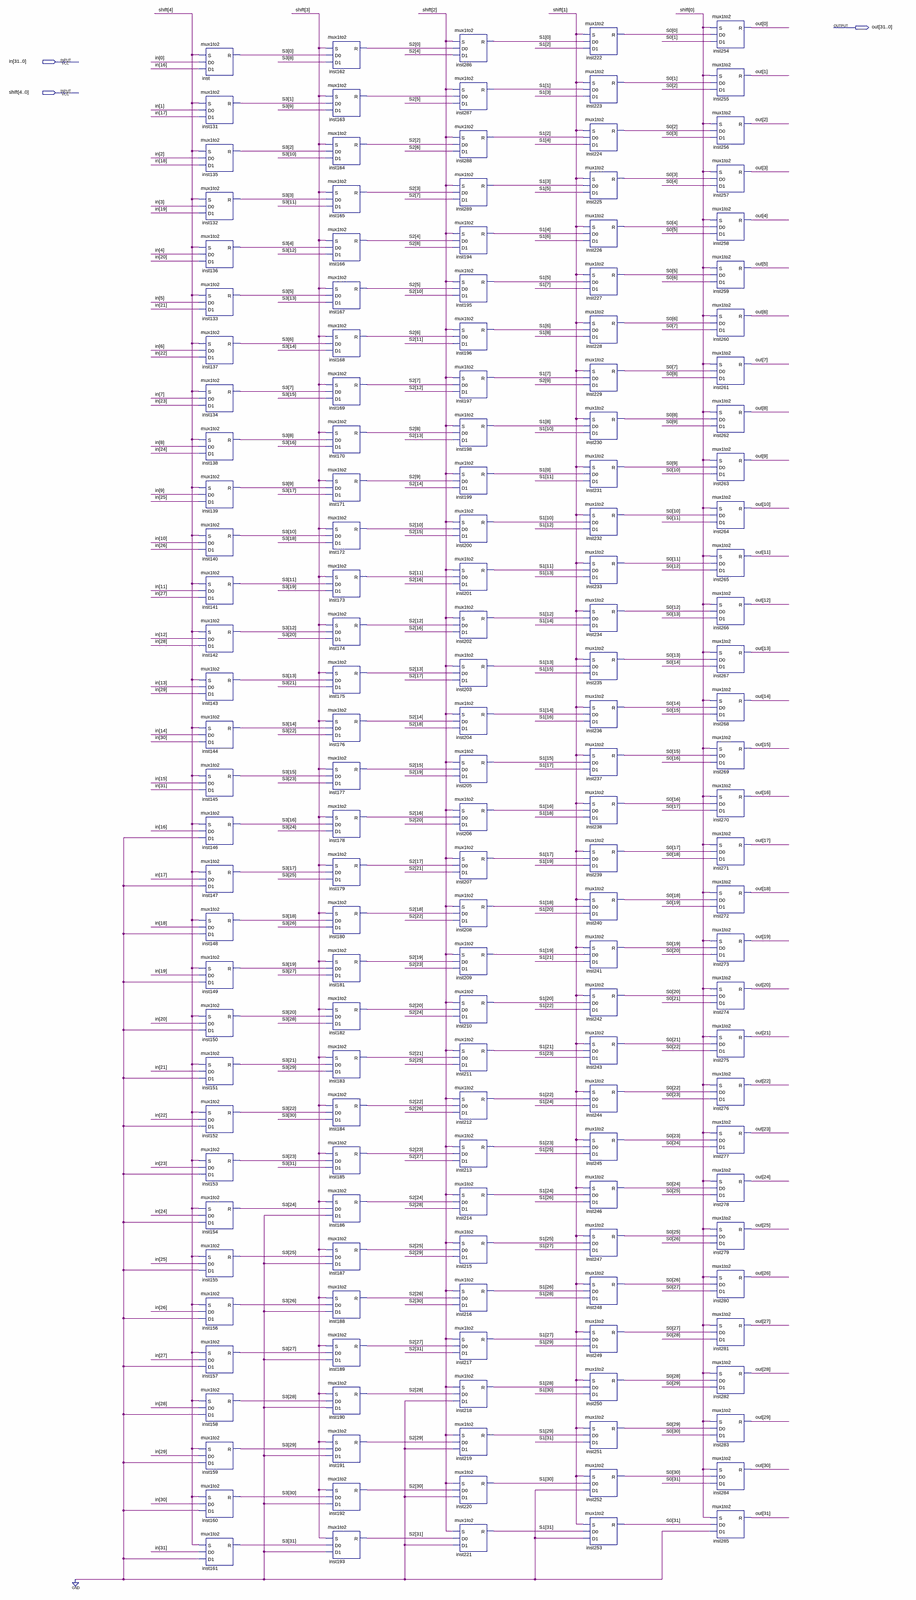
[diagram p0: schematic sheet, whole]
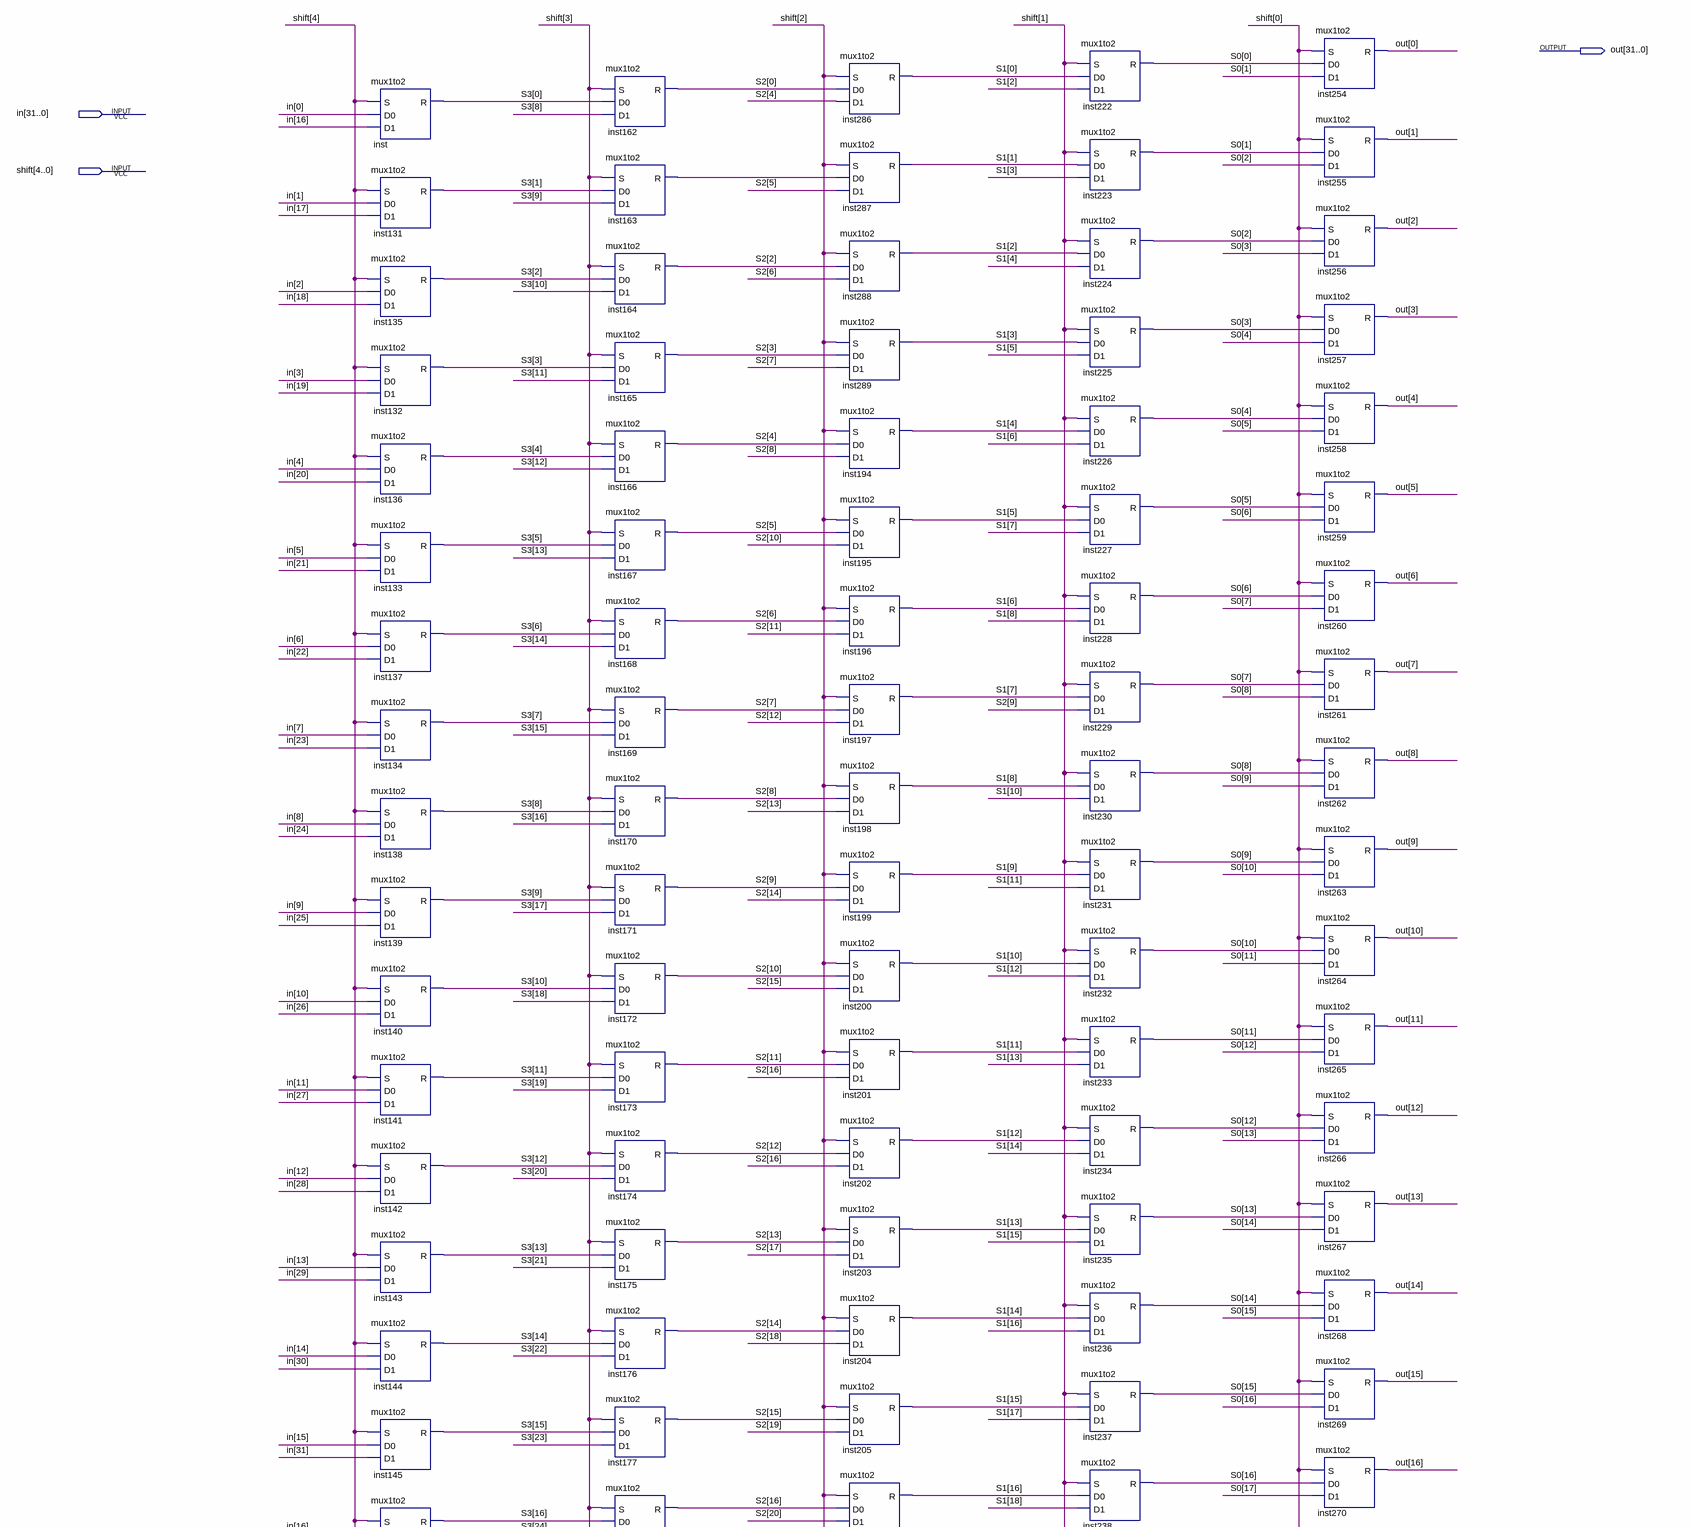
[diagram p1: schematic sheet, upper part]
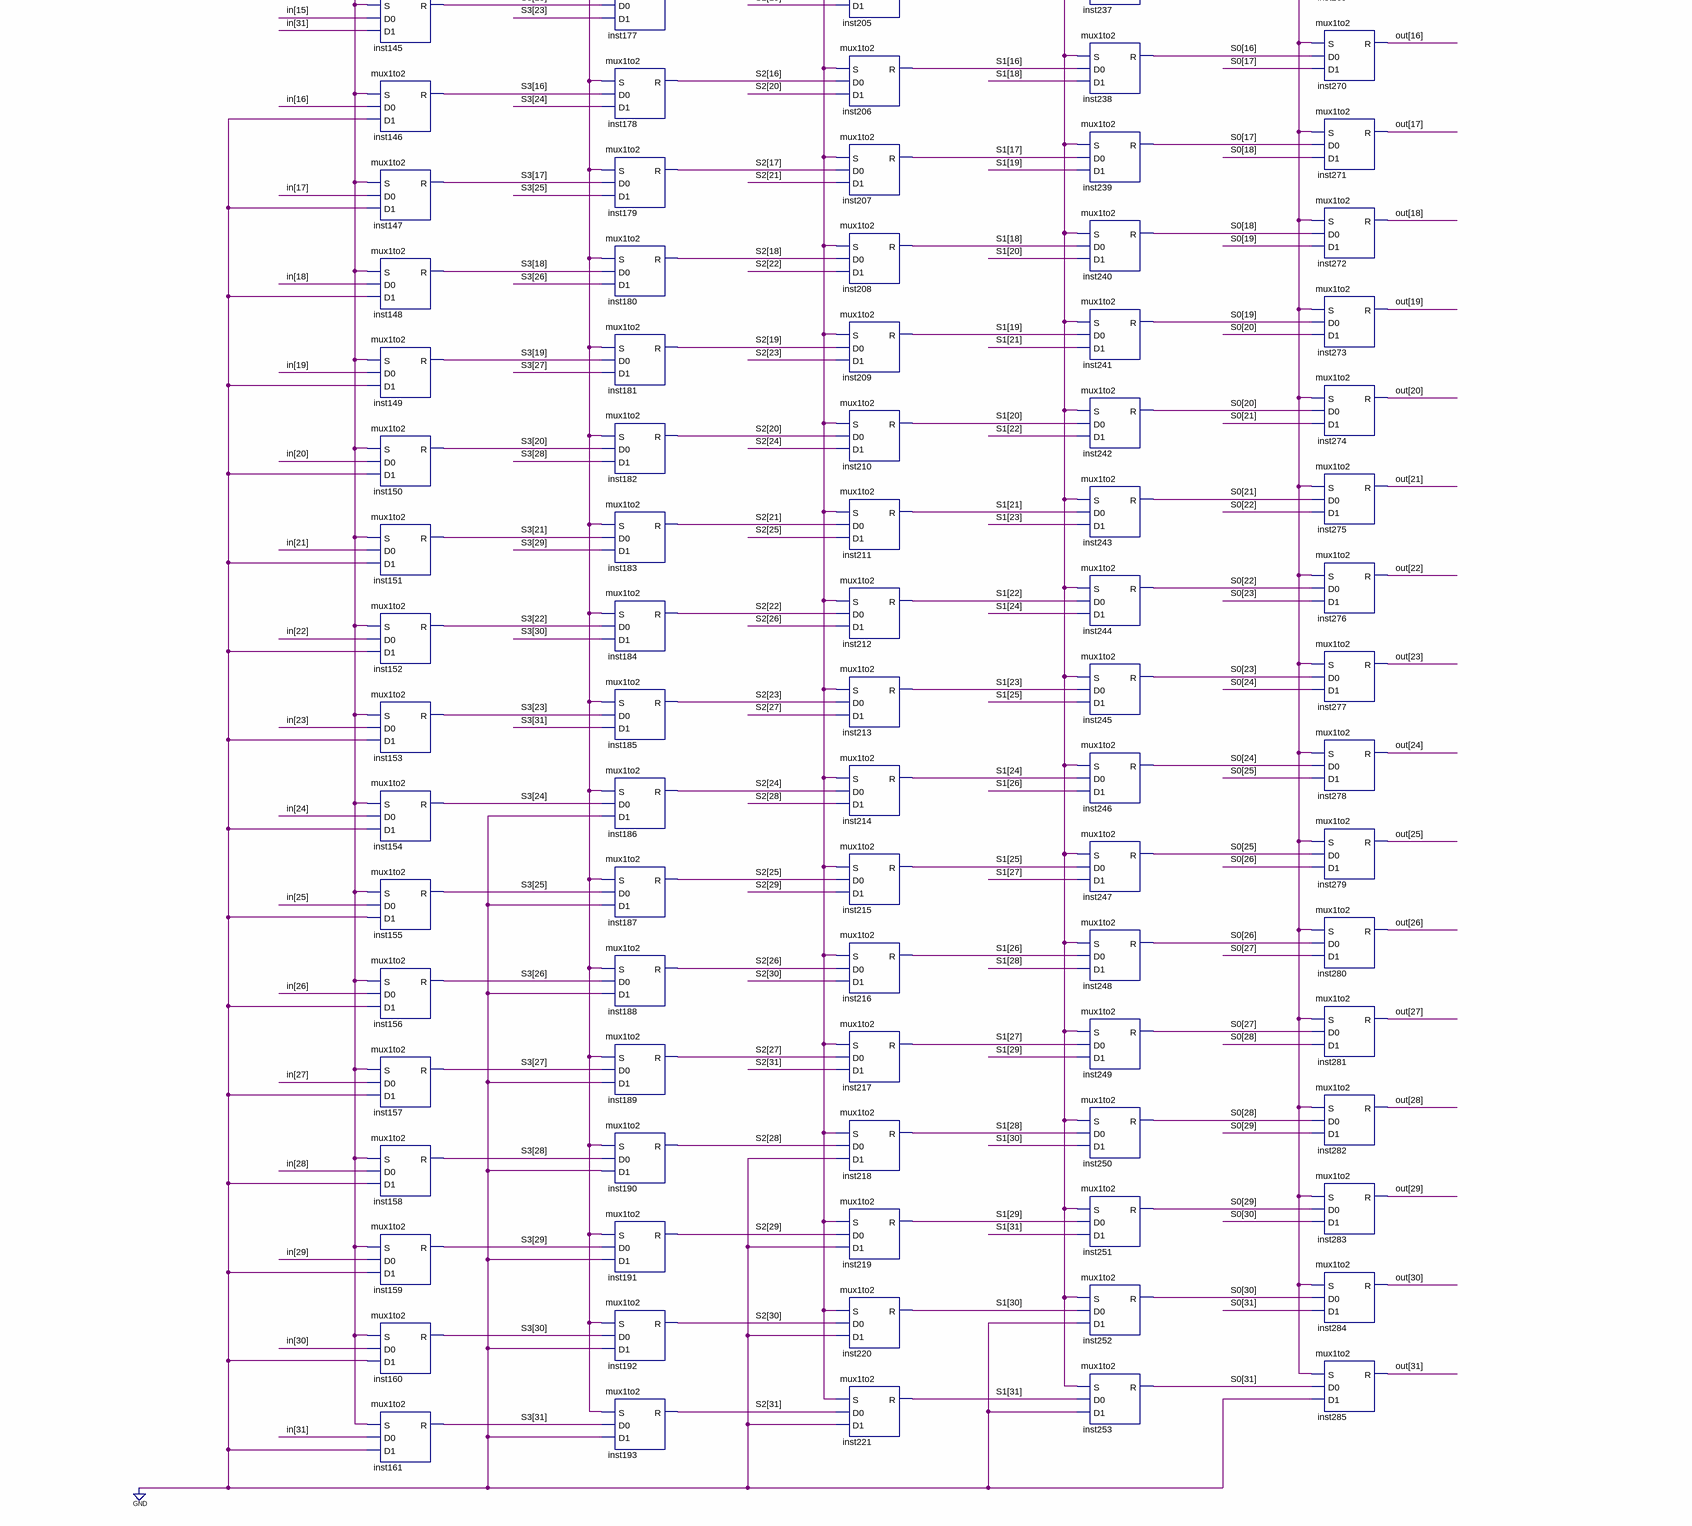
[diagram p2: schematic sheet, lower part]
// Quartus schematic ShiftRight.bdf as structural Verilog: 160 symbols, 3 pins
module ShiftRight (
  input  [31:0] in,
  input  [4:0] shift,
  output [31:0] out
);

  wire inst163_r;
  wire [31:0] S0, S1, S2, S3;

  mux1to2 inst (.S(shift[4]), .D0(in[0]), .D1(in[16]), .R(S3[0]));
  mux1to2 inst131 (.S(shift[4]), .D0(in[1]), .D1(in[17]), .R(S3[1]));
  mux1to2 inst135 (.S(shift[4]), .D0(in[2]), .D1(in[18]), .R(S3[2]));
  mux1to2 inst132 (.S(shift[4]), .D0(in[3]), .D1(in[19]), .R(S3[3]));
  mux1to2 inst136 (.S(shift[4]), .D0(in[4]), .D1(in[20]), .R(S3[4]));
  mux1to2 inst133 (.S(shift[4]), .D0(in[5]), .D1(in[21]), .R(S3[5]));
  mux1to2 inst137 (.S(shift[4]), .D0(in[6]), .D1(in[22]), .R(S3[6]));
  mux1to2 inst134 (.S(shift[4]), .D0(in[7]), .D1(in[23]), .R(S3[7]));
  mux1to2 inst138 (.S(shift[4]), .D0(in[8]), .D1(in[24]), .R(S3[8]));
  mux1to2 inst139 (.S(shift[4]), .D0(in[9]), .D1(in[25]), .R(S3[9]));
  mux1to2 inst140 (.S(shift[4]), .D0(in[10]), .D1(in[26]), .R(S3[10]));
  mux1to2 inst141 (.S(shift[4]), .D0(in[11]), .D1(in[27]), .R(S3[11]));
  mux1to2 inst142 (.S(shift[4]), .D0(in[12]), .D1(in[28]), .R(S3[12]));
  mux1to2 inst143 (.S(shift[4]), .D0(in[13]), .D1(in[29]), .R(S3[13]));
  mux1to2 inst144 (.S(shift[4]), .D0(in[14]), .D1(in[30]), .R(S3[14]));
  mux1to2 inst145 (.S(shift[4]), .D0(in[15]), .D1(in[31]), .R(S3[15]));
  mux1to2 inst146 (.S(shift[4]), .D0(in[16]), .D1(1'b0), .R(S3[16]));
  mux1to2 inst147 (.S(shift[4]), .D0(in[17]), .D1(1'b0), .R(S3[17]));
  mux1to2 inst148 (.S(shift[4]), .D0(in[18]), .D1(1'b0), .R(S3[18]));
  mux1to2 inst149 (.S(shift[4]), .D0(in[19]), .D1(1'b0), .R(S3[19]));
  mux1to2 inst150 (.S(shift[4]), .D0(in[20]), .D1(1'b0), .R(S3[20]));
  mux1to2 inst151 (.S(shift[4]), .D0(in[21]), .D1(1'b0), .R(S3[21]));
  mux1to2 inst152 (.S(shift[4]), .D0(in[22]), .D1(1'b0), .R(S3[22]));
  mux1to2 inst153 (.S(shift[4]), .D0(in[23]), .D1(1'b0), .R(S3[23]));
  mux1to2 inst154 (.S(shift[4]), .D0(in[24]), .D1(1'b0), .R(S3[24]));
  mux1to2 inst155 (.S(shift[4]), .D0(in[25]), .D1(1'b0), .R(S3[25]));
  mux1to2 inst156 (.S(shift[4]), .D0(in[26]), .D1(1'b0), .R(S3[26]));
  mux1to2 inst157 (.S(shift[4]), .D0(in[27]), .D1(1'b0), .R(S3[27]));
  mux1to2 inst158 (.S(shift[4]), .D0(in[28]), .D1(1'b0), .R(S3[28]));
  mux1to2 inst159 (.S(shift[4]), .D0(in[29]), .D1(1'b0), .R(S3[29]));
  mux1to2 inst160 (.S(shift[4]), .D0(in[30]), .D1(1'b0), .R(S3[30]));
  mux1to2 inst161 (.S(shift[4]), .D0(in[31]), .D1(1'b0), .R(S3[31]));
  mux1to2 inst162 (.S(shift[3]), .D0(S3[0]), .D1(S3[8]), .R(S2[0]));
  mux1to2 inst163 (.S(shift[3]), .D0(S3[1]), .D1(S3[9]), .R(inst163_r));
  mux1to2 inst164 (.S(shift[3]), .D0(S3[2]), .D1(S3[10]), .R(S2[2]));
  mux1to2 inst165 (.S(shift[3]), .D0(S3[3]), .D1(S3[11]), .R(S2[3]));
  mux1to2 inst166 (.S(shift[3]), .D0(S3[4]), .D1(S3[12]), .R(S2[4]));
  mux1to2 inst167 (.S(shift[3]), .D0(S3[5]), .D1(S3[13]), .R(S2[5]));
  mux1to2 inst168 (.S(shift[3]), .D0(S3[6]), .D1(S3[14]), .R(S2[6]));
  mux1to2 inst169 (.S(shift[3]), .D0(S3[7]), .D1(S3[15]), .R(S2[7]));
  mux1to2 inst170 (.S(shift[3]), .D0(S3[8]), .D1(S3[16]), .R(S2[8]));
  mux1to2 inst171 (.S(shift[3]), .D0(S3[9]), .D1(S3[17]), .R(S2[9]));
  mux1to2 inst172 (.S(shift[3]), .D0(S3[10]), .D1(S3[18]), .R(S2[10]));
  mux1to2 inst173 (.S(shift[3]), .D0(S3[11]), .D1(S3[19]), .R(S2[11]));
  mux1to2 inst174 (.S(shift[3]), .D0(S3[12]), .D1(S3[20]), .R(S2[12]));
  mux1to2 inst175 (.S(shift[3]), .D0(S3[13]), .D1(S3[21]), .R(S2[13]));
  mux1to2 inst176 (.S(shift[3]), .D0(S3[14]), .D1(S3[22]), .R(S2[14]));
  mux1to2 inst177 (.S(shift[3]), .D0(S3[15]), .D1(S3[23]), .R(S2[15]));
  mux1to2 inst178 (.S(shift[3]), .D0(S3[16]), .D1(S3[24]), .R(S2[16]));
  mux1to2 inst179 (.S(shift[3]), .D0(S3[17]), .D1(S3[25]), .R(S2[17]));
  mux1to2 inst180 (.S(shift[3]), .D0(S3[18]), .D1(S3[26]), .R(S2[18]));
  mux1to2 inst181 (.S(shift[3]), .D0(S3[19]), .D1(S3[27]), .R(S2[19]));
  mux1to2 inst182 (.S(shift[3]), .D0(S3[20]), .D1(S3[28]), .R(S2[20]));
  mux1to2 inst183 (.S(shift[3]), .D0(S3[21]), .D1(S3[29]), .R(S2[21]));
  mux1to2 inst184 (.S(shift[3]), .D0(S3[22]), .D1(S3[30]), .R(S2[22]));
  mux1to2 inst185 (.S(shift[3]), .D0(S3[23]), .D1(S3[31]), .R(S2[23]));
  mux1to2 inst186 (.S(shift[3]), .D0(S3[24]), .D1(1'b0), .R(S2[24]));
  mux1to2 inst187 (.S(shift[3]), .D0(S3[25]), .D1(1'b0), .R(S2[25]));
  mux1to2 inst188 (.S(shift[3]), .D0(S3[26]), .D1(1'b0), .R(S2[26]));
  mux1to2 inst189 (.S(shift[3]), .D0(S3[27]), .D1(1'b0), .R(S2[27]));
  mux1to2 inst190 (.S(shift[3]), .D0(S3[28]), .D1(1'b0), .R(S2[28]));
  mux1to2 inst191 (.S(shift[3]), .D0(S3[29]), .D1(1'b0), .R(S2[29]));
  mux1to2 inst192 (.S(shift[3]), .D0(S3[30]), .D1(1'b0), .R(S2[30]));
  mux1to2 inst193 (.S(shift[3]), .D0(S3[31]), .D1(1'b0), .R(S2[31]));
  mux1to2 inst286 (.S(shift[2]), .D0(S2[0]), .D1(S2[4]), .R(S1[0]));
  mux1to2 inst287 (.S(shift[2]), .D0(inst163_r), .D1(S2[5]), .R(S1[1]));
  mux1to2 inst288 (.S(shift[2]), .D0(S2[2]), .D1(S2[6]), .R(S1[2]));
  mux1to2 inst289 (.S(shift[2]), .D0(S2[3]), .D1(S2[7]), .R(S1[3]));
  mux1to2 inst194 (.S(shift[2]), .D0(S2[4]), .D1(S2[8]), .R(S1[4]));
  mux1to2 inst195 (.S(shift[2]), .D0(S2[5]), .D1(S2[10]), .R(S1[5]));
  mux1to2 inst196 (.S(shift[2]), .D0(S2[6]), .D1(S2[11]), .R(S1[6]));
  mux1to2 inst197 (.S(shift[2]), .D0(S2[7]), .D1(S2[12]), .R(S1[7]));
  mux1to2 inst198 (.S(shift[2]), .D0(S2[8]), .D1(S2[13]), .R(S1[8]));
  mux1to2 inst199 (.S(shift[2]), .D0(S2[9]), .D1(S2[14]), .R(S1[9]));
  mux1to2 inst200 (.S(shift[2]), .D0(S2[10]), .D1(S2[15]), .R(S1[10]));
  mux1to2 inst201 (.S(shift[2]), .D0(S2[11]), .D1(S2[16]), .R(S1[11]));
  mux1to2 inst202 (.S(shift[2]), .D0(S2[12]), .D1(S2[16]), .R(S1[12]));
  mux1to2 inst203 (.S(shift[2]), .D0(S2[13]), .D1(S2[17]), .R(S1[13]));
  mux1to2 inst204 (.S(shift[2]), .D0(S2[14]), .D1(S2[18]), .R(S1[14]));
  mux1to2 inst205 (.S(shift[2]), .D0(S2[15]), .D1(S2[19]), .R(S1[15]));
  mux1to2 inst206 (.S(shift[2]), .D0(S2[16]), .D1(S2[20]), .R(S1[16]));
  mux1to2 inst207 (.S(shift[2]), .D0(S2[17]), .D1(S2[21]), .R(S1[17]));
  mux1to2 inst208 (.S(shift[2]), .D0(S2[18]), .D1(S2[22]), .R(S1[18]));
  mux1to2 inst209 (.S(shift[2]), .D0(S2[19]), .D1(S2[23]), .R(S1[19]));
  mux1to2 inst210 (.S(shift[2]), .D0(S2[20]), .D1(S2[24]), .R(S1[20]));
  mux1to2 inst211 (.S(shift[2]), .D0(S2[21]), .D1(S2[25]), .R(S1[21]));
  mux1to2 inst212 (.S(shift[2]), .D0(S2[22]), .D1(S2[26]), .R(S1[22]));
  mux1to2 inst213 (.S(shift[2]), .D0(S2[23]), .D1(S2[27]), .R(S1[23]));
  mux1to2 inst214 (.S(shift[2]), .D0(S2[24]), .D1(S2[28]), .R(S1[24]));
  mux1to2 inst215 (.S(shift[2]), .D0(S2[25]), .D1(S2[29]), .R(S1[25]));
  mux1to2 inst216 (.S(shift[2]), .D0(S2[26]), .D1(S2[30]), .R(S1[26]));
  mux1to2 inst217 (.S(shift[2]), .D0(S2[27]), .D1(S2[31]), .R(S1[27]));
  mux1to2 inst218 (.S(shift[2]), .D0(S2[28]), .D1(1'b0), .R(S1[28]));
  mux1to2 inst219 (.S(shift[2]), .D0(S2[29]), .D1(1'b0), .R(S1[29]));
  mux1to2 inst220 (.S(shift[2]), .D0(S2[30]), .D1(1'b0), .R(S1[30]));
  mux1to2 inst221 (.S(shift[2]), .D0(S2[31]), .D1(1'b0), .R(S1[31]));
  mux1to2 inst222 (.S(shift[1]), .D0(S1[0]), .D1(S1[2]), .R(S0[0]));
  mux1to2 inst223 (.S(shift[1]), .D0(S1[1]), .D1(S1[3]), .R(S0[1]));
  mux1to2 inst224 (.S(shift[1]), .D0(S1[2]), .D1(S1[4]), .R(S0[2]));
  mux1to2 inst225 (.S(shift[1]), .D0(S1[3]), .D1(S1[5]), .R(S0[3]));
  mux1to2 inst226 (.S(shift[1]), .D0(S1[4]), .D1(S1[6]), .R(S0[4]));
  mux1to2 inst227 (.S(shift[1]), .D0(S1[5]), .D1(S1[7]), .R(S0[5]));
  mux1to2 inst228 (.S(shift[1]), .D0(S1[6]), .D1(S1[8]), .R(S0[6]));
  mux1to2 inst229 (.S(shift[1]), .D0(S1[7]), .D1(S2[9]), .R(S0[7]));
  mux1to2 inst230 (.S(shift[1]), .D0(S1[8]), .D1(S1[10]), .R(S0[8]));
  mux1to2 inst231 (.S(shift[1]), .D0(S1[9]), .D1(S1[11]), .R(S0[9]));
  mux1to2 inst232 (.S(shift[1]), .D0(S1[10]), .D1(S1[12]), .R(S0[10]));
  mux1to2 inst233 (.S(shift[1]), .D0(S1[11]), .D1(S1[13]), .R(S0[11]));
  mux1to2 inst234 (.S(shift[1]), .D0(S1[12]), .D1(S1[14]), .R(S0[12]));
  mux1to2 inst235 (.S(shift[1]), .D0(S1[13]), .D1(S1[15]), .R(S0[13]));
  mux1to2 inst236 (.S(shift[1]), .D0(S1[14]), .D1(S1[16]), .R(S0[14]));
  mux1to2 inst237 (.S(shift[1]), .D0(S1[15]), .D1(S1[17]), .R(S0[15]));
  mux1to2 inst238 (.S(shift[1]), .D0(S1[16]), .D1(S1[18]), .R(S0[16]));
  mux1to2 inst239 (.S(shift[1]), .D0(S1[17]), .D1(S1[19]), .R(S0[17]));
  mux1to2 inst240 (.S(shift[1]), .D0(S1[18]), .D1(S1[20]), .R(S0[18]));
  mux1to2 inst241 (.S(shift[1]), .D0(S1[19]), .D1(S1[21]), .R(S0[19]));
  mux1to2 inst242 (.S(shift[1]), .D0(S1[20]), .D1(S1[22]), .R(S0[20]));
  mux1to2 inst243 (.S(shift[1]), .D0(S1[21]), .D1(S1[23]), .R(S0[21]));
  mux1to2 inst244 (.S(shift[1]), .D0(S1[22]), .D1(S1[24]), .R(S0[22]));
  mux1to2 inst245 (.S(shift[1]), .D0(S1[23]), .D1(S1[25]), .R(S0[23]));
  mux1to2 inst246 (.S(shift[1]), .D0(S1[24]), .D1(S1[26]), .R(S0[24]));
  mux1to2 inst247 (.S(shift[1]), .D0(S1[25]), .D1(S1[27]), .R(S0[25]));
  mux1to2 inst248 (.S(shift[1]), .D0(S1[26]), .D1(S1[28]), .R(S0[26]));
  mux1to2 inst249 (.S(shift[1]), .D0(S1[27]), .D1(S1[29]), .R(S0[27]));
  mux1to2 inst250 (.S(shift[1]), .D0(S1[28]), .D1(S1[30]), .R(S0[28]));
  mux1to2 inst251 (.S(shift[1]), .D0(S1[29]), .D1(S1[31]), .R(S0[29]));
  mux1to2 inst252 (.S(shift[1]), .D0(S1[30]), .D1(1'b0), .R(S0[30]));
  mux1to2 inst253 (.S(shift[1]), .D0(S1[31]), .D1(1'b0), .R(S0[31]));
  mux1to2 inst254 (.S(shift[0]), .D0(S0[0]), .D1(S0[1]), .R(out[0]));
  mux1to2 inst255 (.S(shift[0]), .D0(S0[1]), .D1(S0[2]), .R(out[1]));
  mux1to2 inst256 (.S(shift[0]), .D0(S0[2]), .D1(S0[3]), .R(out[2]));
  mux1to2 inst257 (.S(shift[0]), .D0(S0[3]), .D1(S0[4]), .R(out[3]));
  mux1to2 inst258 (.S(shift[0]), .D0(S0[4]), .D1(S0[5]), .R(out[4]));
  mux1to2 inst259 (.S(shift[0]), .D0(S0[5]), .D1(S0[6]), .R(out[5]));
  mux1to2 inst260 (.S(shift[0]), .D0(S0[6]), .D1(S0[7]), .R(out[6]));
  mux1to2 inst261 (.S(shift[0]), .D0(S0[7]), .D1(S0[8]), .R(out[7]));
  mux1to2 inst262 (.S(shift[0]), .D0(S0[8]), .D1(S0[9]), .R(out[8]));
  mux1to2 inst263 (.S(shift[0]), .D0(S0[9]), .D1(S0[10]), .R(out[9]));
  mux1to2 inst264 (.S(shift[0]), .D0(S0[10]), .D1(S0[11]), .R(out[10]));
  mux1to2 inst265 (.S(shift[0]), .D0(S0[11]), .D1(S0[12]), .R(out[11]));
  mux1to2 inst266 (.S(shift[0]), .D0(S0[12]), .D1(S0[13]), .R(out[12]));
  mux1to2 inst267 (.S(shift[0]), .D0(S0[13]), .D1(S0[14]), .R(out[13]));
  mux1to2 inst268 (.S(shift[0]), .D0(S0[14]), .D1(S0[15]), .R(out[14]));
  mux1to2 inst269 (.S(shift[0]), .D0(S0[15]), .D1(S0[16]), .R(out[15]));
  mux1to2 inst270 (.S(shift[0]), .D0(S0[16]), .D1(S0[17]), .R(out[16]));
  mux1to2 inst271 (.S(shift[0]), .D0(S0[17]), .D1(S0[18]), .R(out[17]));
  mux1to2 inst272 (.S(shift[0]), .D0(S0[18]), .D1(S0[19]), .R(out[18]));
  mux1to2 inst273 (.S(shift[0]), .D0(S0[19]), .D1(S0[20]), .R(out[19]));
  mux1to2 inst274 (.S(shift[0]), .D0(S0[20]), .D1(S0[21]), .R(out[20]));
  mux1to2 inst275 (.S(shift[0]), .D0(S0[21]), .D1(S0[22]), .R(out[21]));
  mux1to2 inst276 (.S(shift[0]), .D0(S0[22]), .D1(S0[23]), .R(out[22]));
  mux1to2 inst277 (.S(shift[0]), .D0(S0[23]), .D1(S0[24]), .R(out[23]));
  mux1to2 inst278 (.S(shift[0]), .D0(S0[24]), .D1(S0[25]), .R(out[24]));
  mux1to2 inst279 (.S(shift[0]), .D0(S0[25]), .D1(S0[26]), .R(out[25]));
  mux1to2 inst280 (.S(shift[0]), .D0(S0[26]), .D1(S0[27]), .R(out[26]));
  mux1to2 inst281 (.S(shift[0]), .D0(S0[27]), .D1(S0[28]), .R(out[27]));
  mux1to2 inst282 (.S(shift[0]), .D0(S0[28]), .D1(S0[29]), .R(out[28]));
  mux1to2 inst283 (.S(shift[0]), .D0(S0[29]), .D1(S0[30]), .R(out[29]));
  mux1to2 inst284 (.S(shift[0]), .D0(S0[30]), .D1(S0[31]), .R(out[30]));
  mux1to2 inst285 (.S(shift[0]), .D0(S0[31]), .D1(1'b0), .R(out[31]));
endmodule
